# Altium schematic sheet CONTROL.SchDoc
size 558 x 431 mm
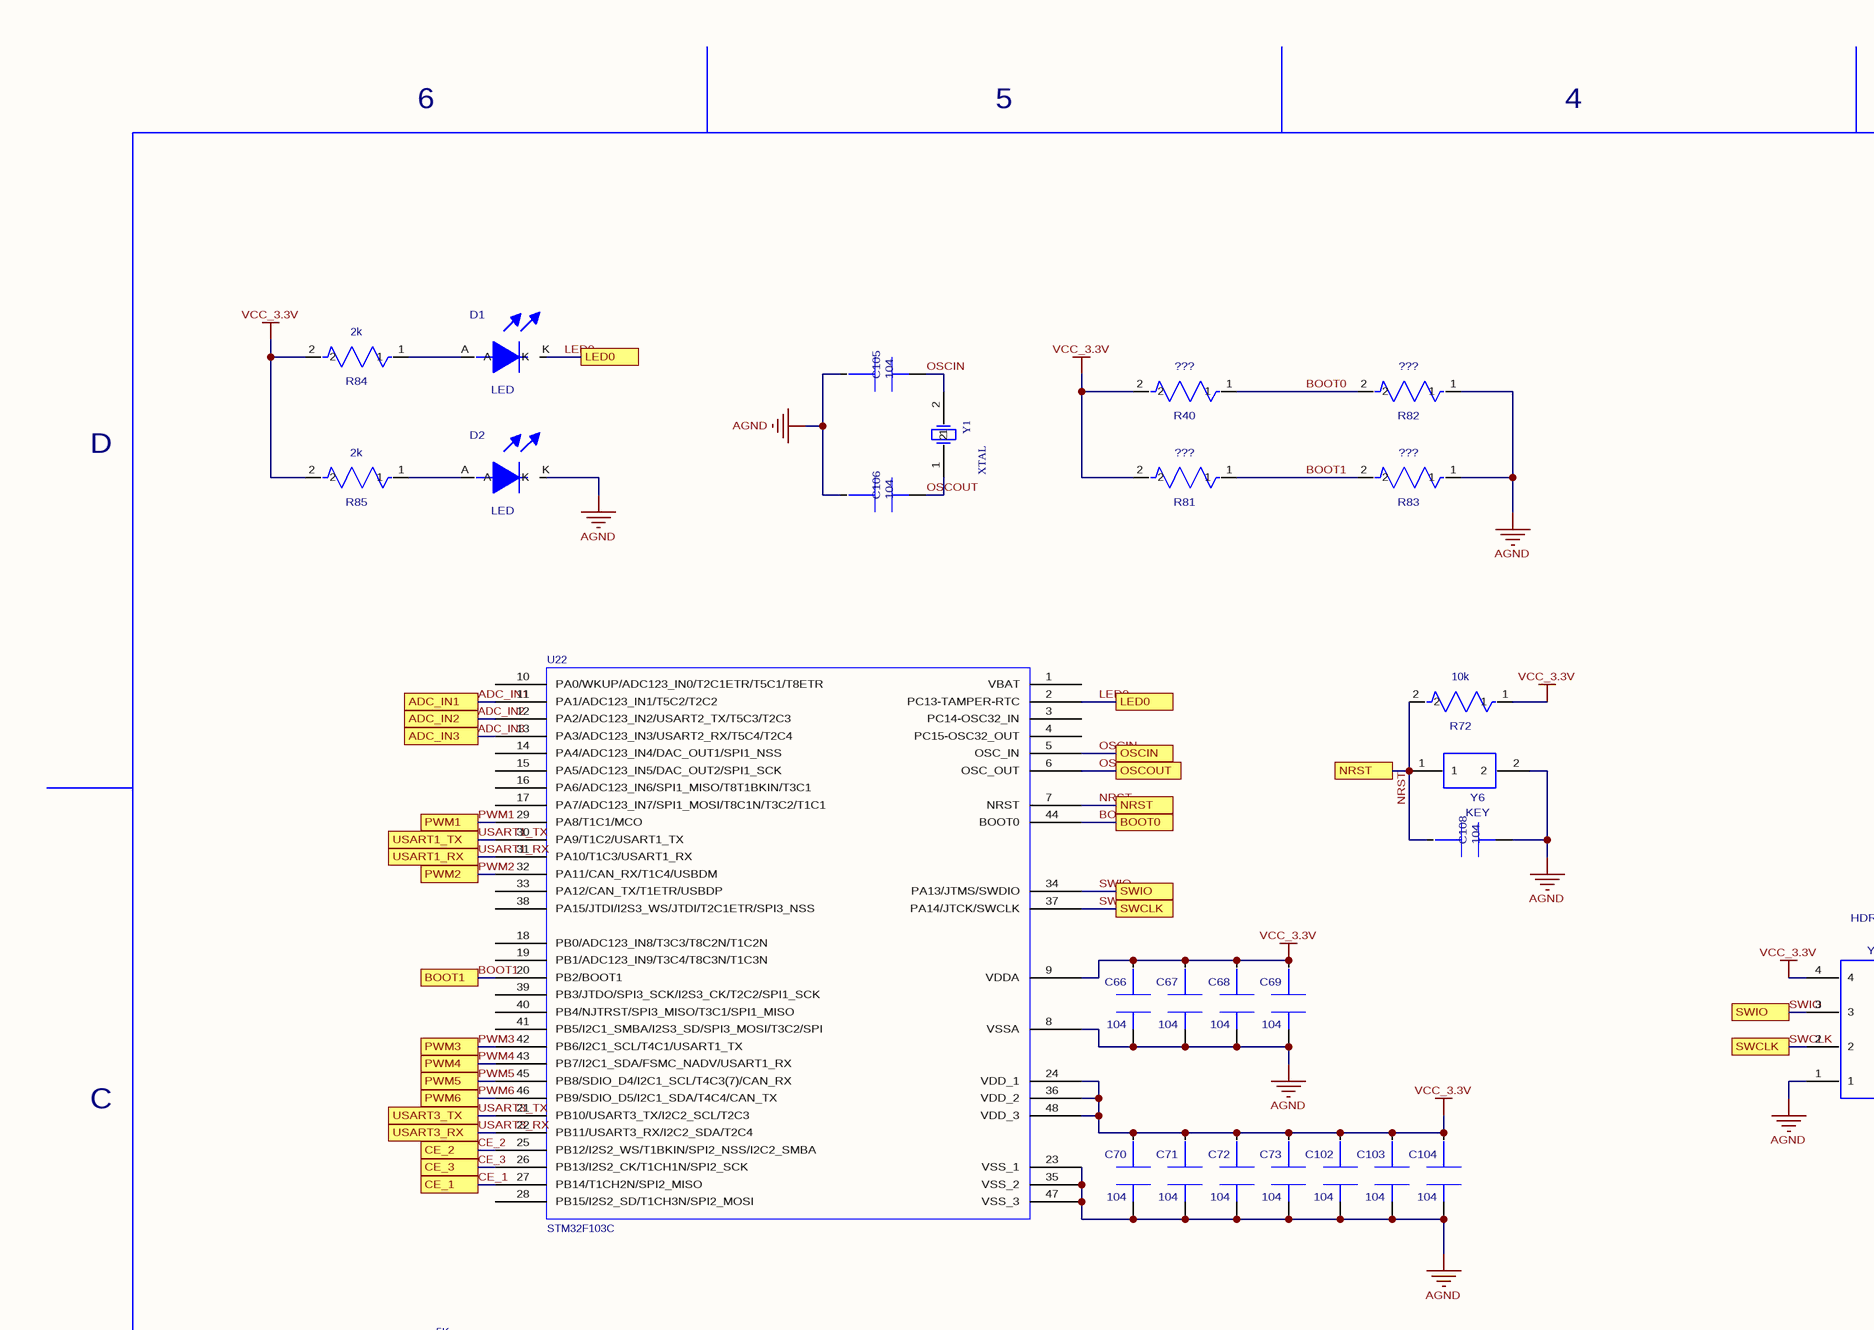
[diagram p0: CONTROL.SchDoc, top left]
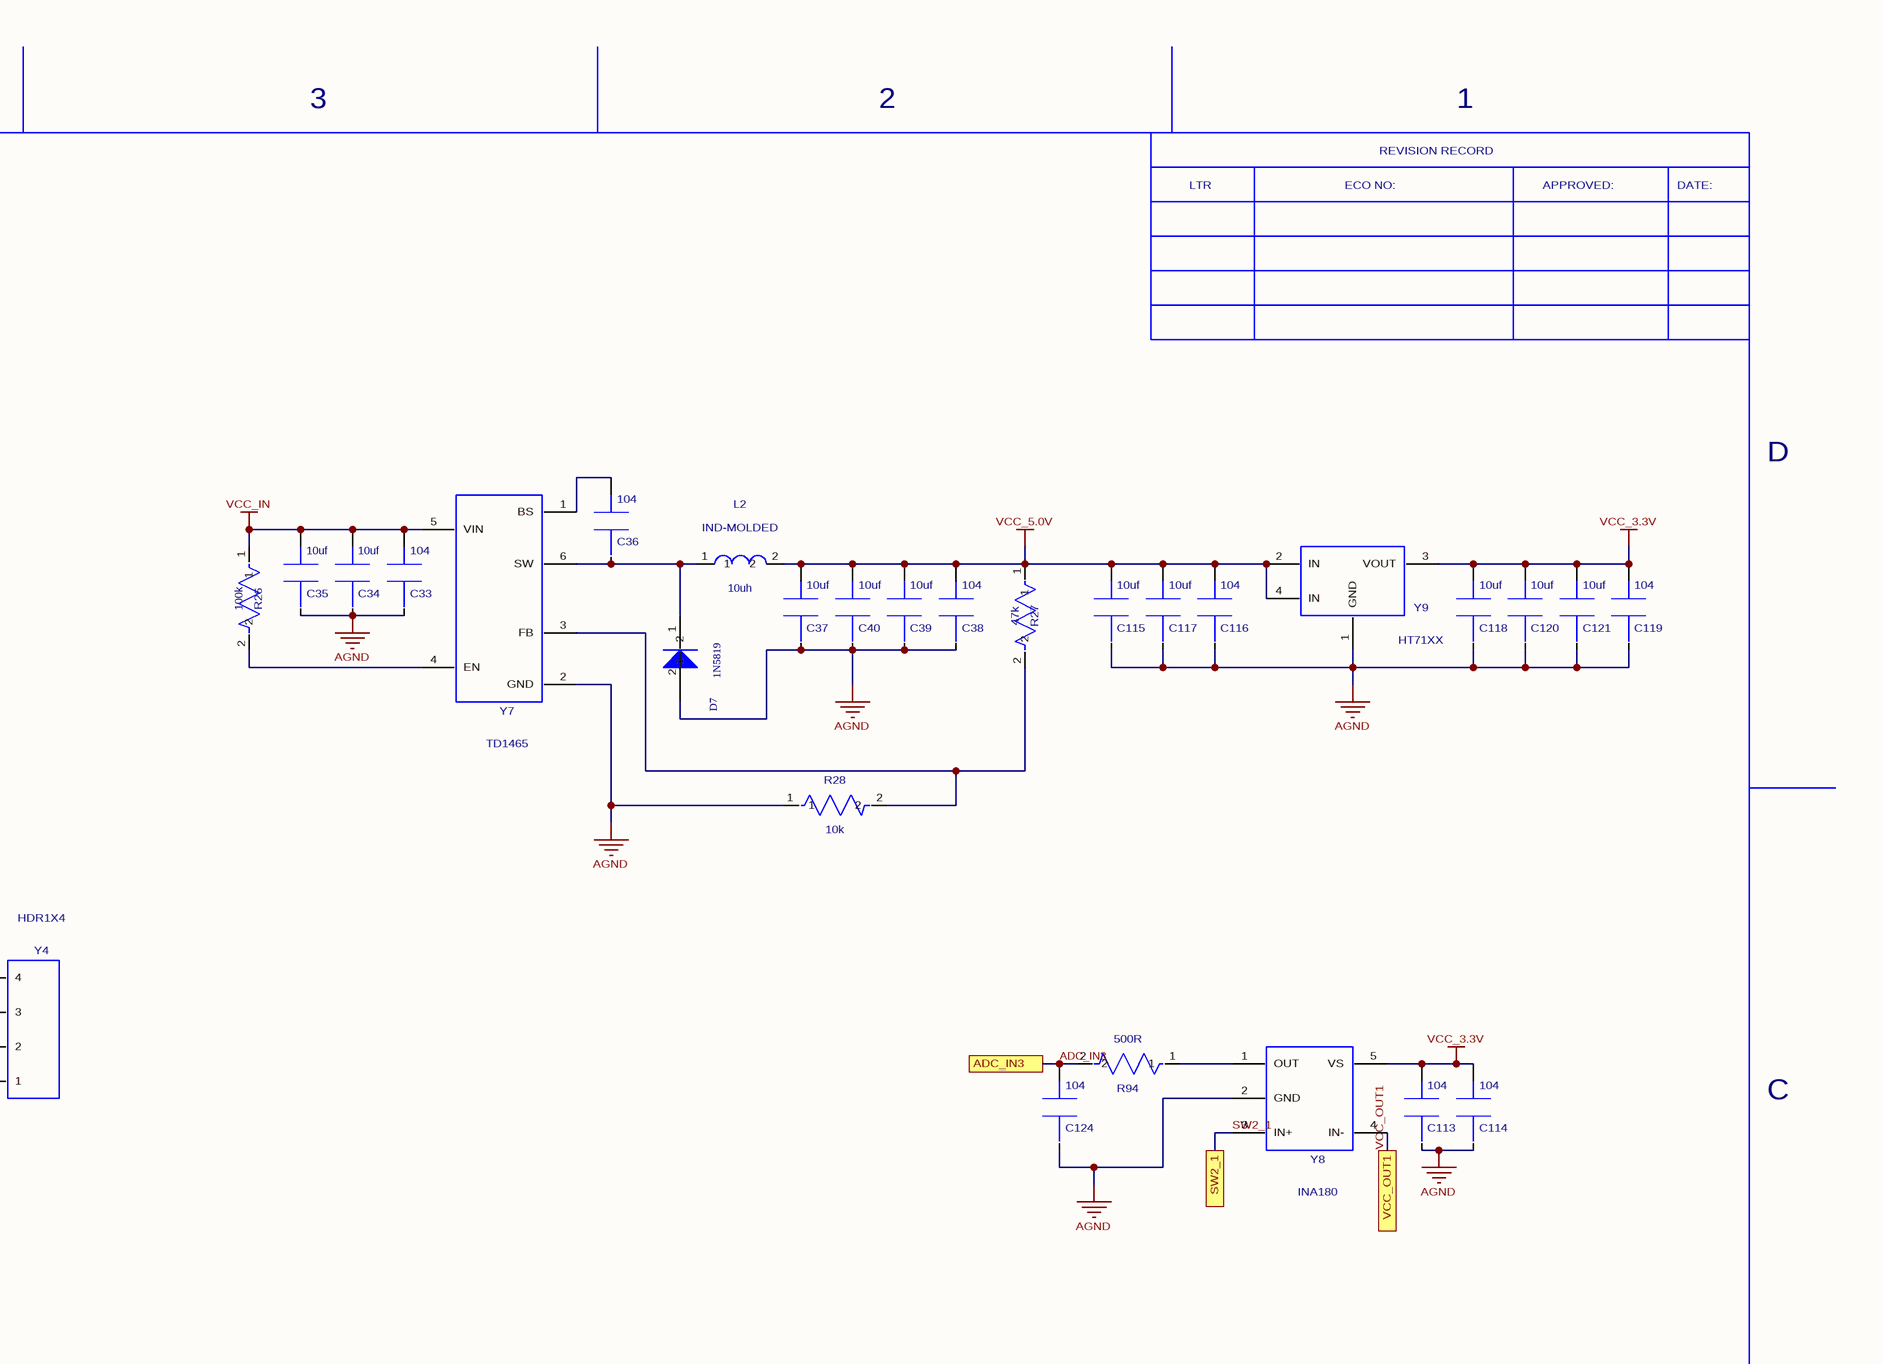
[diagram p1: CONTROL.SchDoc, top right]
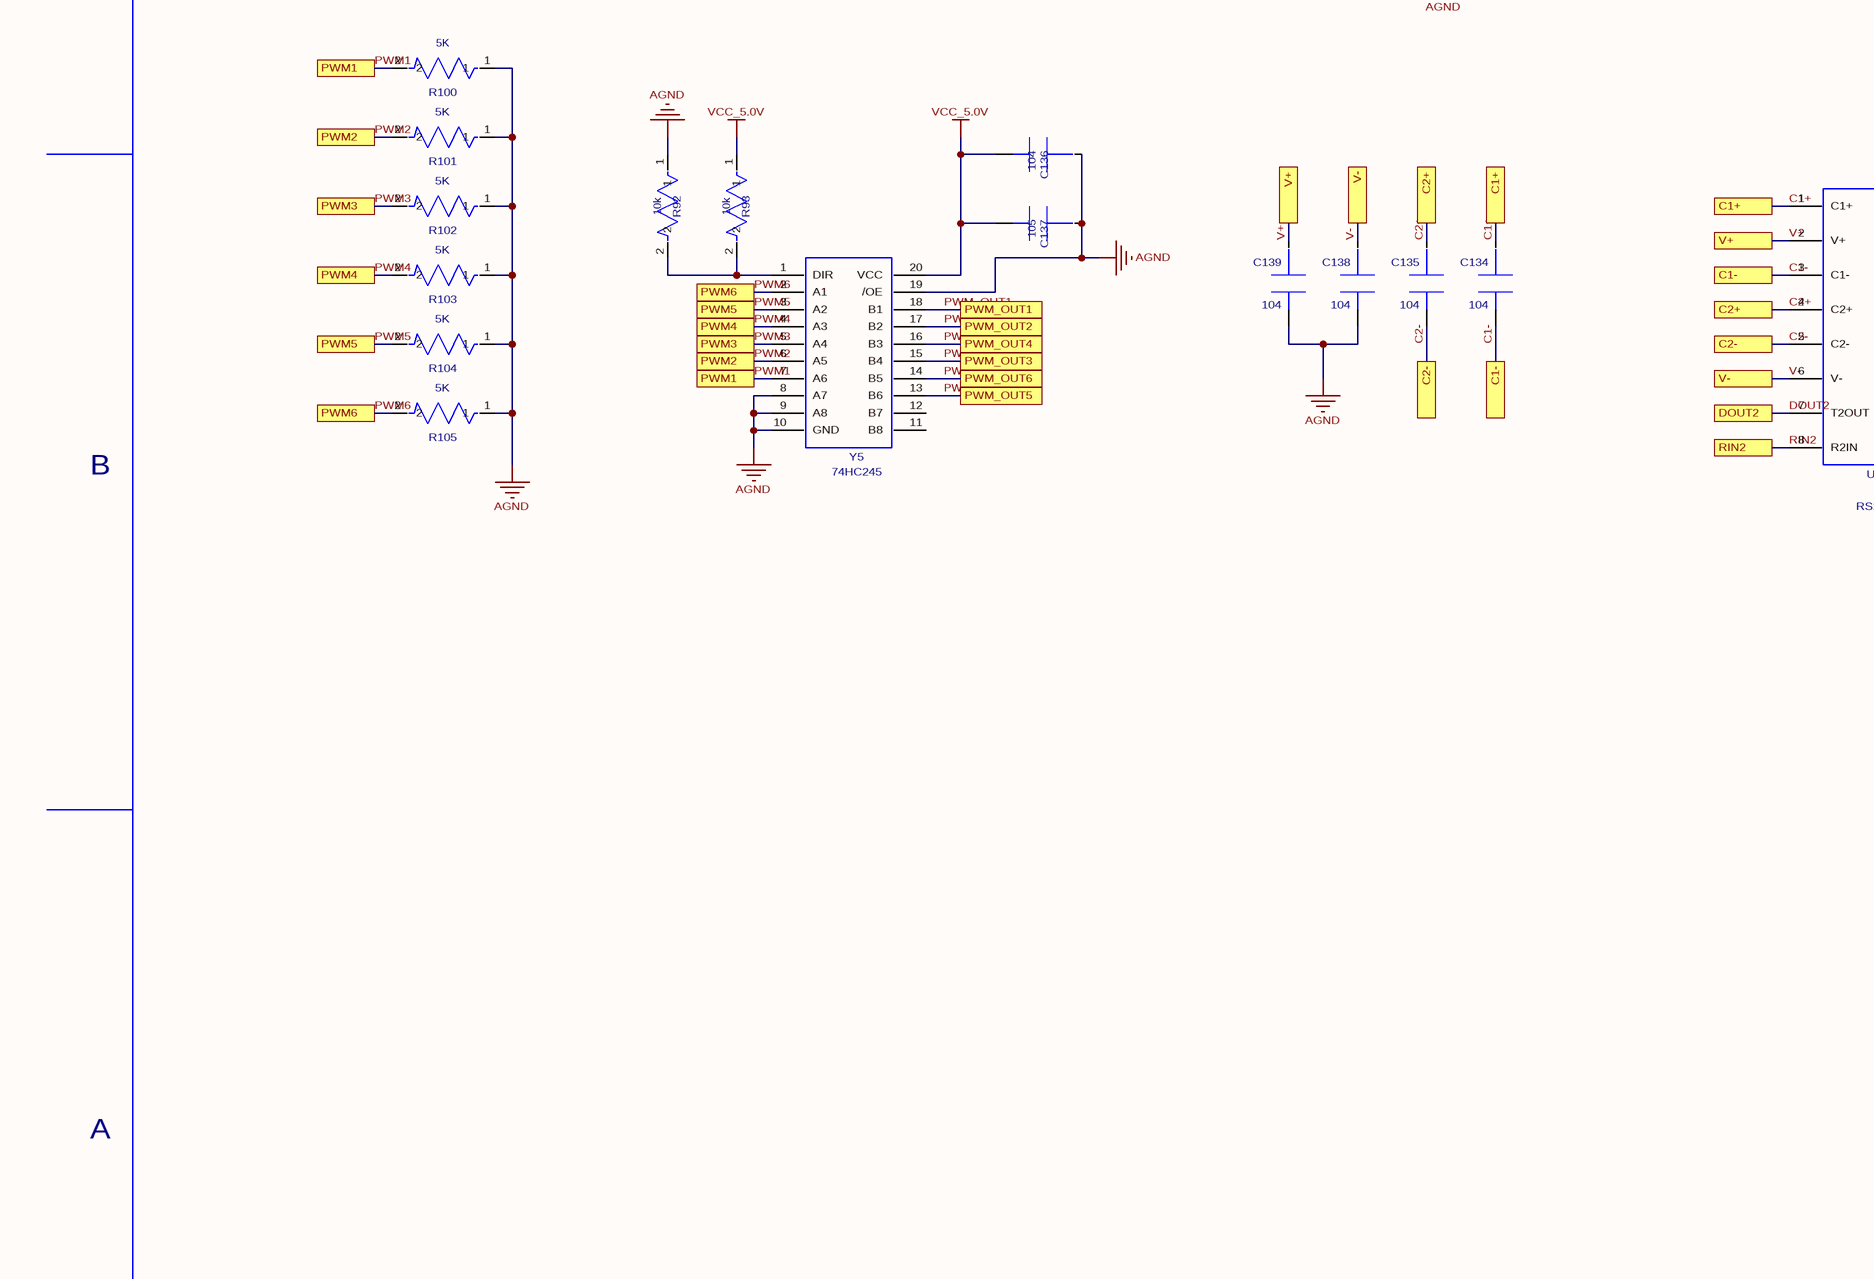
[diagram p2: CONTROL.SchDoc, bottom left]
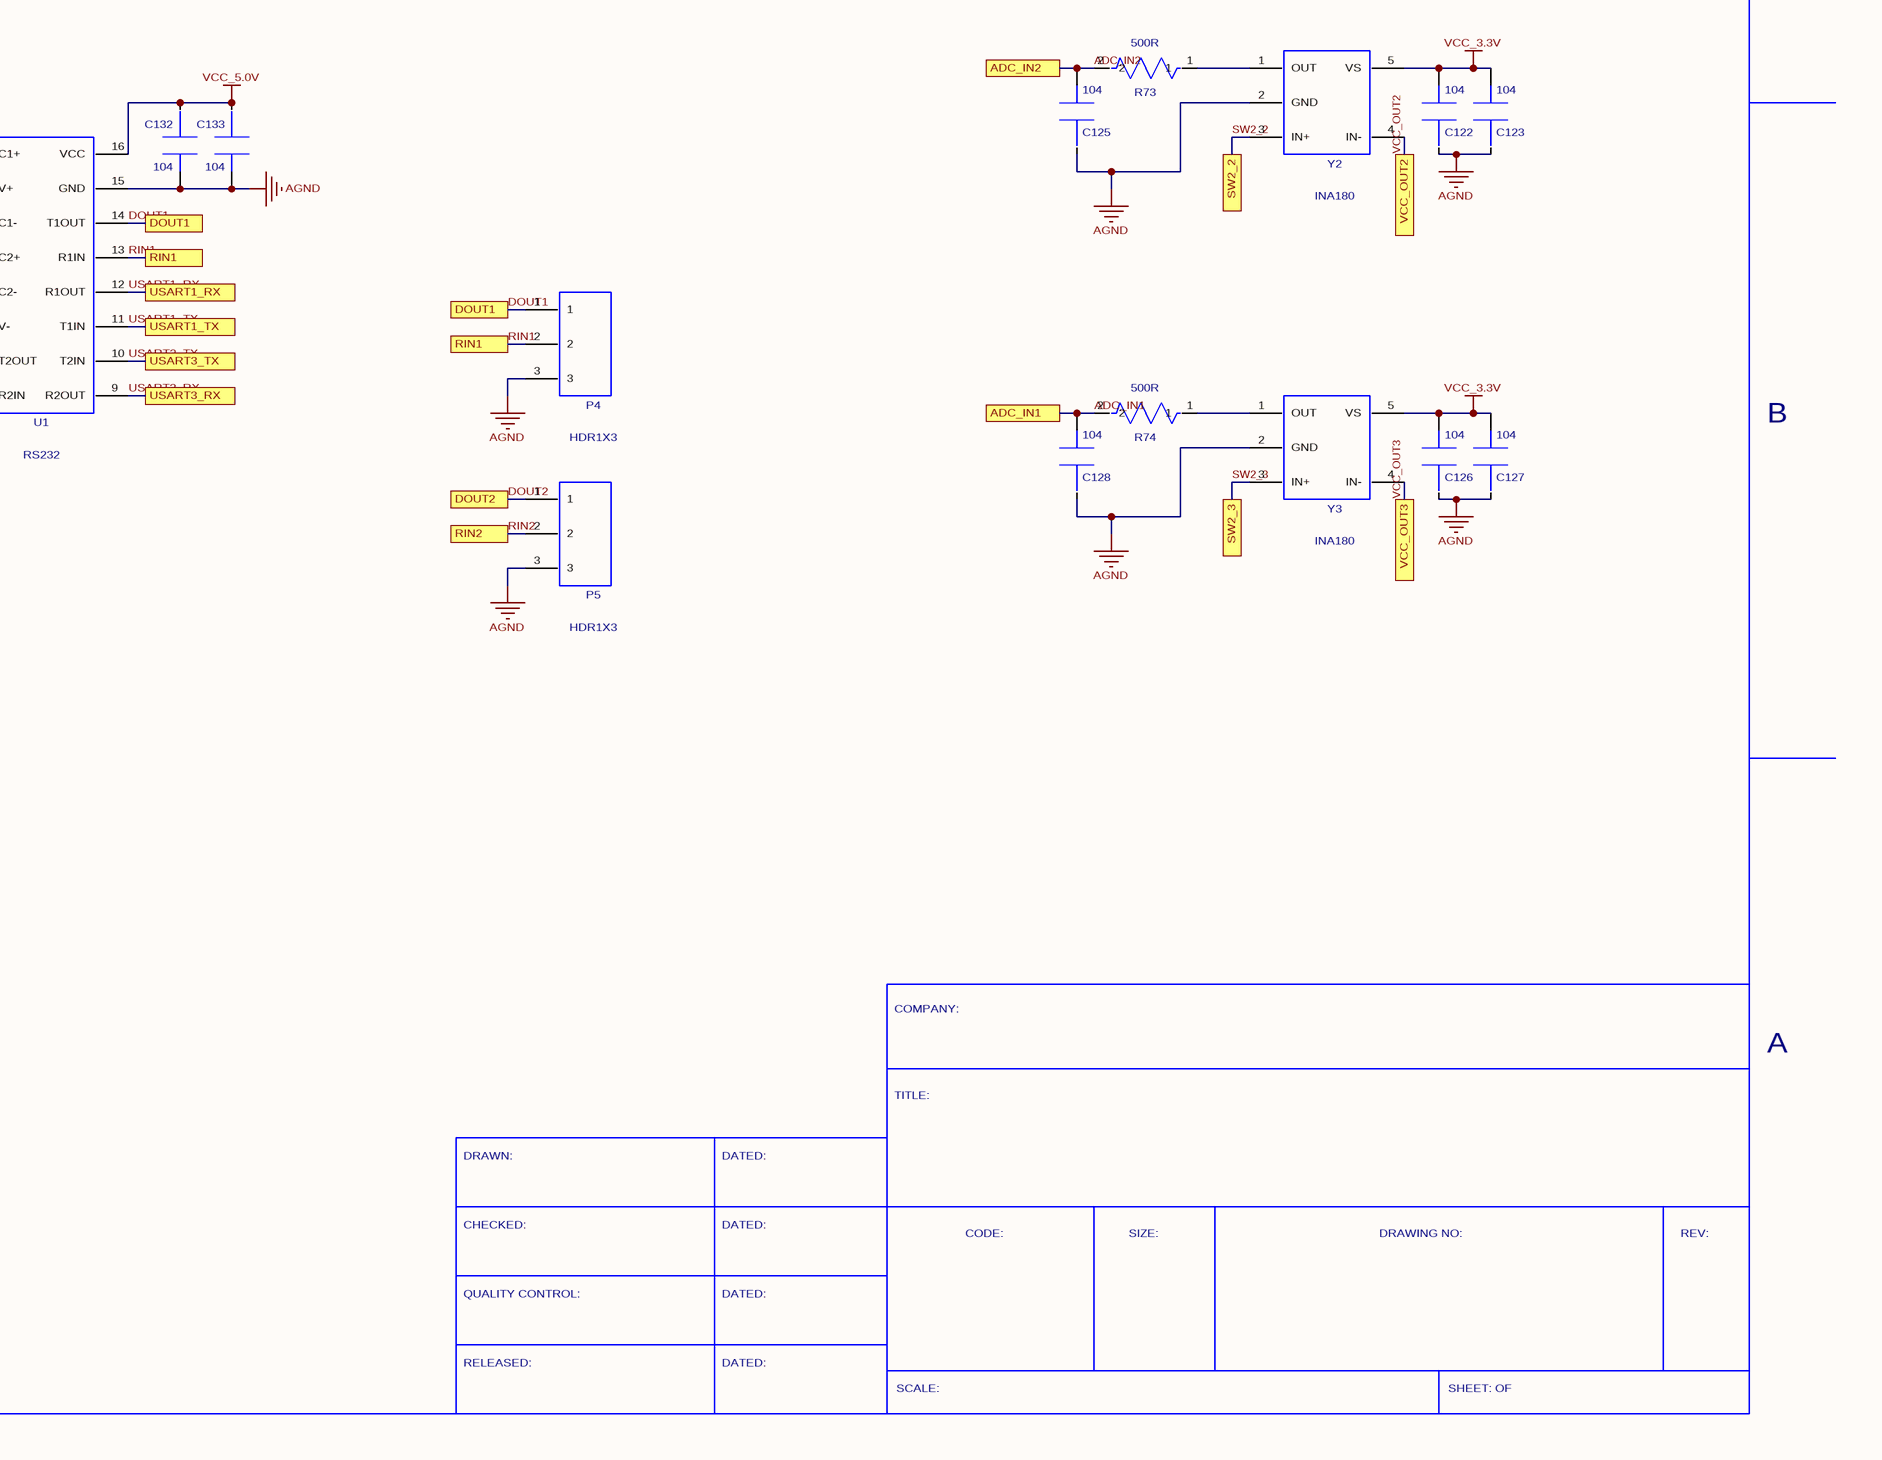
[diagram p3: CONTROL.SchDoc, bottom right]

## Parts
C33  value 104  [0805C]  (hidden comment: CAP-CFR04R-C)
C34  value 10uf  [0805C]  (hidden comment: CAP-CFR04R-C)
C35  value 10uf  [0805C]  (hidden comment: CAP-CFR04R-C)
C36  value 104  [0805C]  (hidden comment: CAP-CFR04R-C)
C37  value 10uf  [0805C]  (hidden comment: CAP-CFR04R-C)
C38  value 104  [0805C]  (hidden comment: CAP-CFR04R-C)
C39  value 10uf  [0805C]  (hidden comment: CAP-CFR04R-C)
C40  value 10uf  [0805C]  (hidden comment: CAP-CFR04R-C)
C66  value 104  [0805C]  (hidden comment: CAP-CFR04R-C)
C67  value 104  [0805C]  (hidden comment: CAP-CFR04R-C)
C68  value 104  [0805C]  (hidden comment: CAP-CFR04R-C)
C69  value 104  [0805C]  (hidden comment: CAP-CFR04R-C)
C70  value 104  [0805C]  (hidden comment: CAP-CFR04R-C)
C71  value 104  [0805C]  (hidden comment: CAP-CFR04R-C)
C72  value 104  [0805C]  (hidden comment: CAP-CFR04R-C)
C73  value 104  [0805C]  (hidden comment: CAP-CFR04R-C)
C102  value 104  [0805C]  (hidden comment: CAP-CFR04R-C)
C103  value 104  [0805C]  (hidden comment: CAP-CFR04R-C)
C104  value 104  [0805C]  (hidden comment: CAP-CFR04R-C)
C105  value 104  [0805C]  (hidden comment: CAP-CFR04R-C)
C106  value 104  [0805C]  (hidden comment: CAP-CFR04R-C)
C108  value 104  [0805C]  (hidden comment: CAP-CFR04R-C)
C113  value 104  [0805C]  (hidden comment: CAP-CFR04R-C)
C114  value 104  [0805C]  (hidden comment: CAP-CFR04R-C)
C115  value 10uf  [0805C]  (hidden comment: CAP-CFR04R-C)
C116  value 104  [0805C]  (hidden comment: CAP-CFR04R-C)
C117  value 10uf  [0805C]  (hidden comment: CAP-CFR04R-C)
C118  value 10uf  [0805C]  (hidden comment: CAP-CFR04R-C)
C119  value 104  [0805C]  (hidden comment: CAP-CFR04R-C)
C120  value 10uf  [0805C]  (hidden comment: CAP-CFR04R-C)
C121  value 10uf  [0805C]  (hidden comment: CAP-CFR04R-C)
C122  value 104  [0805C]  (hidden comment: CAP-CFR04R-C)
C123  value 104  [0805C]  (hidden comment: CAP-CFR04R-C)
C124  value 104  [0805C]  (hidden comment: CAP-CFR04R-C)
C125  value 104  [0805C]  (hidden comment: CAP-CFR04R-C)
C126  value 104  [0805C]  (hidden comment: CAP-CFR04R-C)
C127  value 104  [0805C]  (hidden comment: CAP-CFR04R-C)
C128  value 104  [0805C]  (hidden comment: CAP-CFR04R-C)
C132  value 104  [0805C]  (hidden comment: CAP-CFR04R-C)
C133  value 104  [0805C]  (hidden comment: CAP-CFR04R-C)
C134  value 104  [0805C]  (hidden comment: CAP-CFR04R-C)
C135  value 104  [0805C]  (hidden comment: CAP-CFR04R-C)
C136  value 104  [0805C]  (hidden comment: CAP-CFR04R-C)
C137  value 105  [0603C]  (hidden comment: CAP-CFR04R-C)
C138  value 104  [0805C]  (hidden comment: CAP-CFR04R-C)
C139  value 104  [0805C]  (hidden comment: CAP-CFR04R-C)
D1  LED  [0805D]
D2  LED  [0805D]
D7  1N5819  [SOD-123_L2.8-W1.8-LS3.7-RD]
L2  IND-MOLDED  value 10uh  [L-SMD-0630]
P4  HDR1X3  [POST_3]
P5  HDR1X3  [POST_3]
R26  value 100k  [0603R]  (hidden comment: RES-WR1)
R27  value 47k  [0603R]  (hidden comment: RES-WR1)
R28  value 10k  [0603R]  (hidden comment: RES-WR1)
R40  value ???  [0603R]  (hidden comment: RES-WR1)
R72  value 10k  [0603R]  (hidden comment: RES-WR1)
R73  value 500R  [0603R]  (hidden comment: RES-WR1)
R74  value 500R  [0603R]  (hidden comment: RES-WR1)
R81  value ???  [0603R]  (hidden comment: RES-WR1)
R82  value ???  [0603R]  (hidden comment: RES-WR1)
R83  value ???  [0603R]  (hidden comment: RES-WR1)
R84  value 2k  [0805R]  (hidden comment: RES-WR1)
R85  value 2k  [0805R]  (hidden comment: RES-WR1)
R92  value 10k  [0603R]  (hidden comment: RES-WR1)
R93  value 10k  [0603R]  (hidden comment: RES-WR1)
R94  value 500R  [0603R]  (hidden comment: RES-WR1)
R100  value 5K  [0603R]  (hidden comment: RES-WR1)
R101  value 5K  [0603R]  (hidden comment: RES-WR1)
R102  value 5K  [0603R]  (hidden comment: RES-WR1)
R103  value 5K  [0603R]  (hidden comment: RES-WR1)
R104  value 5K  [0603R]  (hidden comment: RES-WR1)
R105  value 5K  [0603R]  (hidden comment: RES-WR1)
U1  RS232  [SOP-16_L9.9-W3.9-P1.27-LS6.1-BL]
U22  STM32F103C  [LQFP-48_M]
Y1  XTAL  [HC-49S_L11.4-W4.8]
Y2  INA180  [SOT-23-5_L3.0-W1.7-P0.95-LS2.8-BL]
Y3  INA180  [SOT-23-5_L3.0-W1.7-P0.95-LS2.8-BL]
Y4  HDR1X4  [HDR1X4]
Y5  74HC245  [TSSOP-20_L6.5-W4.4-P0.65-LS6.4-BL]
Y6  KEY  [KEY_3_6_2.5]
Y7  TD1465  [SOT-23-6]
Y8  INA180  [SOT-23-5_L3.0-W1.7-P0.95-LS2.8-BL]
Y9  HT71XX  [SOT-89-3_L4.5-W2.5-P1.50-LS4.2-BR]

## Ports
ADC_IN1, ADC_IN2, ADC_IN3, BOOT0, BOOT1, C1+, C1-, C2+, C2-, CE_1, CE_2, CE_3, DOUT1, DOUT2, LED0, NRST, OSCIN, OSCOUT, PWM1, PWM2, PWM3, PWM4, PWM5, PWM6, PWM_OUT1, PWM_OUT2, PWM_OUT3, PWM_OUT4, PWM_OUT5, PWM_OUT6, RIN1, RIN2, SW2_1, SW2_2, SW2_3, SWCLK, SWIO, USART1_RX, USART1_TX, USART3_RX, USART3_TX, V+, V-, VCC_OUT1, VCC_OUT2, VCC_OUT3

## Nets
AGND: C33.1 C34.1 C35.1 C37.1 C38.1 C39.1 C40.1 C66.2 C67.2 C68.2 C69.2 C70.2 C71.2 C72.2 C73.2 C102.2 C103.2 C104.2 C105.1 C106.1 C108.2 C113.1 C114.1 C115.1 C116.1 C117.1 C118.1 C119.1 C120.1 C121.1 C122.1 C123.1 C124.1 C125.1 C126.1 C127.1 C128.1 C132.2 C133.2 C136.1 C137.1 C138.2 C139.2 D2.K D7.2 P4.3 P5.3 R28.1 R82.1 R83.1 R92.1 R100.1 R101.1 R102.1 R103.1 R104.1 R105.1 U1.15(GND) U22.8(VSSA) U22.23(VSS_1) U22.35(VSS_2) U22.47(VSS_3) Y2.2(GND) Y3.2(GND) Y4.1 Y5.8(A7) Y5.9(A8) Y5.10(GND) Y5.19(/OE) Y6.2 Y7.2(GND) Y8.2(GND) Y9.1(GND)
VCC_3.3V: C66.1 C67.1 C68.1 C69.1 C70.1 C71.1 C72.1 C73.1 C102.1 C103.1 C104.1 C113.2 C114.2 C118.2 C119.2 C120.2 C121.2 C122.2 C123.2 C126.2 C127.2 R40.2 R72.1 R81.2 R84.2 R85.2 U22.9(VDDA) U22.24(VDD_1) U22.36(VDD_2) U22.48(VDD_3) Y2.5(VS) Y3.5(VS) Y4.4 Y8.5(VS) Y9.3(VOUT)
VCC_5.0V: C37.2 C38.2 C39.2 C40.2 C115.2 C116.2 C117.2 C132.1 C133.1 C136.2 C137.2 L2.2 R27.1 R93.1 U1.16(VCC) Y5.20(VCC) Y9.2(IN) Y9.4(IN)
VCC_IN: C33.2 C34.2 C35.2 R26.1 Y7.5(VIN)
ADC_IN1: C128.2 R74.2 U22.11(PA1/ADC123_IN1/T5C2/T2C2) ; port ADC_IN1
ADC_IN2: C125.2 R73.2 U22.12(PA2/ADC123_IN2/USART2_TX/T5C3/T2C3) ; port ADC_IN2
ADC_IN3: C124.2 R94.2 U22.13(PA3/ADC123_IN3/USART2_RX/T5C4/T2C4) ; port ADC_IN3
BOOT0: R40.1 R82.2 U22.44(BOOT0) ; port BOOT0
BOOT1: R81.1 R83.2 U22.20(PB2/BOOT1) ; port BOOT1
C1+: C134.1 U1.1(C1+) ; port C1+
C1-: C134.2 U1.3(C1-) ; port C1-
C2+: C135.1 U1.4(C2+) ; port C2+
C2-: C135.2 U1.5(C2-) ; port C2-
CE_1: U22.27(PB14/T1CH2N/SPI2_MISO) ; port CE_1
CE_2: U22.25(PB12/I2S2_WS/T1BKIN/SPI2_NSS/I2C2_SMBA) ; port CE_2
CE_3: U22.26(PB13/I2S2_CK/T1CH1N/SPI2_SCK) ; port CE_3
DOUT1: P4.1 U1.14(T1OUT) ; port DOUT1
DOUT2: P5.1 U1.7(T2OUT) ; port DOUT2
LED0: D1.K U22.2(PC13-TAMPER-RTC) ; port LED0
NRST: C108.1 R72.2 U22.7(NRST) Y6.1 ; port NRST
OSCIN: C105.2 U22.5(OSC_IN) Y1.2 ; port OSCIN
OSCOUT: C106.2 U22.6(OSC_OUT) Y1.1 ; port OSCOUT
PWM1: R100.2 U22.29(PA8/T1C1/MCO) Y5.7(A6) ; port PWM1
PWM2: R101.2 U22.32(PA11/CAN_RX/T1C4/USBDM) Y5.6(A5) ; port PWM2
PWM3: R102.2 U22.42(PB6/I2C1_SCL/T4C1/USART1_TX) Y5.5(A4) ; port PWM3
PWM4: R103.2 U22.43(PB7/I2C1_SDA/FSMC_NADV/USART1_RX) Y5.4(A3) ; port PWM4
PWM5: R104.2 U22.45(PB8/SDIO_D4/I2C1_SCL/T4C3(7)/CAN_RX) Y5.3(A2) ; port PWM5
PWM6: R105.2 U22.46(PB9/SDIO_D5/I2C1_SDA/T4C4/CAN_TX) Y5.2(A1) ; port PWM6
PWM_OUT1: Y5.18(B1) ; port PWM_OUT1
PWM_OUT2: Y5.17(B2) ; port PWM_OUT2
PWM_OUT3: Y5.15(B4) ; port PWM_OUT3
PWM_OUT4: Y5.16(B3) ; port PWM_OUT4
PWM_OUT5: Y5.13(B6) ; port PWM_OUT5
PWM_OUT6: Y5.14(B5) ; port PWM_OUT6
RIN1: P4.2 U1.13(R1IN) ; port RIN1
RIN2: P5.2 U1.8(R2IN) ; port RIN2
SW2_1: Y8.3(IN+) ; port SW2_1
SW2_2: Y2.3(IN+) ; port SW2_2
SW2_3: Y3.3(IN+) ; port SW2_3
SWCLK: U22.37(PA14/JTCK/SWCLK) Y4.2 ; port SWCLK
SWIO: U22.34(PA13/JTMS/SWDIO) Y4.3 ; port SWIO
USART1_RX: U1.12(R1OUT) U22.31(PA10/T1C3/USART1_RX) ; port USART1_RX
USART1_TX: U1.11(T1IN) U22.30(PA9/T1C2/USART1_TX) ; port USART1_TX
USART3_RX: U1.9(R2OUT) U22.22(PB11/USART3_RX/I2C2_SDA/T2C4) ; port USART3_RX
USART3_TX: U1.10(T2IN) U22.21(PB10/USART3_TX/I2C2_SCL/T2C3) ; port USART3_TX
V+: C139.1 U1.2(V+) ; port V+
V-: C138.1 U1.6(V-) ; port V-
VCC_OUT1: Y8.4(IN-) ; port VCC_OUT1
VCC_OUT2: Y2.4(IN-) ; port VCC_OUT2
VCC_OUT3: Y3.4(IN-) ; port VCC_OUT3
NetC36_1: C36.1 D7.1 L2.1 Y7.6(SW)
NetC36_2: C36.2 Y7.1(BS)
NetD1_A: D1.A R84.1
NetD2_A: D2.A R85.1
NetR26_2: R26.2 Y7.4(EN)
NetR27_2: R27.2 R28.2 Y7.3(FB)
NetR73_1: R73.1 Y2.1(OUT)
NetR74_1: R74.1 Y3.1(OUT)
NetR92_2: R92.2 R93.2 Y5.1(DIR)
NetR94_1: R94.1 Y8.1(OUT)

Not connected (* = marked no-connect by the designer): U22 1(VBAT) 3(PC14-OSC32_IN) 4(PC15-OSC32_OUT) 10(PA0/WKUP/ADC123_IN0/T2C1ETR/T5C1/T8ETR) 14(PA4/ADC123_IN4/DAC_OUT1/SPI1_NSS) 15(PA5/ADC123_IN5/DAC_OUT2/SPI1_SCK) 16(PA6/ADC123_IN6/SPI1_MISO/T8T1BKIN/T3C1) 17(PA7/ADC123_IN7/SPI1_MOSI/T8C1N/T3C2/T1C1) 18(PB0/ADC123_IN8/T3C3/T8C2N/T1C2N) 19(PB1/ADC123_IN9/T3C4/T8C3N/T1C3N) 28(PB15/I2S2_SD/T1CH3N/SPI2_MOSI) 33(PA12/CAN_TX/T1ETR/USBDP) 38(PA15/JTDI/I2S3_WS/JTDI/T2C1ETR/SPI3_NSS) 39(PB3/JTDO/SPI3_SCK/I2S3_CK/T2C2/SPI1_SCK) 40(PB4/NJTRST/SPI3_MISO/T3C1/SPI1_MISO) 41(PB5/I2C1_SMBA/I2S3_SD/SPI3_MOSI/T3C2/SPI); Y5 11(B8) 12(B7)

## Notes on the sheet
- 6
- 5
- 4
- 3
- 2
- 1
- LTR
- ECO NO:
- REVISION RECORD
- APPROVED:
- DATE:
- D
- C
- B
- COMPANY:
- A
- TITLE:
- DRAWN:
- DATED:
- CHECKED:
- CODE:
- SIZE:
- DRAWING NO:
- REV:
- QUALITY CONTROL:
- RELEASED:
- SCALE:
- SHEET: OF

## Library data of the parts
C33-C40 C66-C73 C102-C106 C108 C113-C128 C132-C139 = CAP-CFR04R-C: RADIAL FILM CAPACITOR, MIL-SPEC SIZE CFR04R SIZE 'C'; Manufacturer #1: KEMET; Part Number: TBD; Voltage Rating: ???; Sim.Analog.Prefix: C; Sim.Analog.Order: Model$; Tolerance: ???
  C33-C40 C66-C73 C102-C106 C108 C113-C128 C132-C136 C138 C139: PCB DECAL: 0805C
  C137: PCB DECAL: 0603C
D1 D2 = LED: LIGHT EMITTING DIODE; Sim.Analog.Order: Model$; Sim.Analog.Prefix: D; Color: ???; PCB DECAL: 0805D
D7 = DIODE_1N4148: High Conductance Fast Diode; ComponentLink2URL: http://www.fairchildsemi.com/ds/1N%2F1N4148.pdf; ComponentLink2Description: Datasheet; ComponentLink1URL: http://www.fairchildsemi.com/; ComponentLink1Description: Manufacturer Link; Code_JEDEC: DO-204-AH; PackageDescription: Diode, Axial; Body 3.8 x 1.9 mm (LxDia. max), Lead Dia. 0.53 mm (max); Publisher: Altium Limited; PackageReference: DO-35; DatasheetVersion: 1997; LatestRevisionNote: Re-released for DXP Platform.; LatestRevisionDate: 17-Jul-2002; Published: 8-Jun-2000; PCB DECAL: SOD-123_L2.8-W1.8-LS3.7-RD; Comment_1: DIODE_1N4148
L2 = IND-MOLDED: MOLDED INDUCTOR, 0.5" PIN SPACING; Sim.Analog.Order: Model$; Sim.Analog.Prefix: L; PCB DECAL: L-SMD-0630
R26-R28 R40 R72-R74 R81-R85 R92-R94 R100-R105 = RES-WR1: WIRE WOUND RESISTOR 3.4 X 7.05 MM; Manufacturer #1: IPC SM-782 STD.; Sim.Analog.Order: Model$; Sim.Analog.Prefix: R
  R26-R28 R40 R72-R74 R81-R83 R92-R94 R100-R105: PCB DECAL: 0603R
  R84 R85: PCB DECAL: 0805R
U22 = STM32F103C: STM32单片机48引脚; PCB DECAL: LQFP-48_M; Comment_1: STM32F103C
Y1 = XTAL: Crystal Oscillator; PackageDescription: Crystal, Thru-Hole; 2 Leads; Body 3.1 x 8.2 mm (Dia.xH); Publisher: Altium Limited; PackageReference: R38; LatestRevisionNote: Re-released for DXP Platform.; LatestRevisionDate: 17-Jul-2002; Published: 8-Jun-2000; PCB DECAL: HC-49S_L11.4-W4.8; Comment_1: XTAL
Y5 = 74HC04: PCB DECAL: TSSOP-20_L6.5-W4.4-P0.65-LS6.4-BL
P4 P5 = HDR1X3: PCB DECAL: POST_3
U1 = RS232: PCB DECAL: SOP-16_L9.9-W3.9-P1.27-LS6.1-BL
Y2 Y3 Y8 = INA180: PCB DECAL: SOT-23-5_L3.0-W1.7-P0.95-LS2.8-BL
Y4 = HDR1X4: PCB DECAL: HDR1X4
Y6 = KEY: PCB DECAL: KEY_3_6_2.5
Y7 = TD1465: PCB DECAL: SOT-23-6
Y9 = HT71XX: PCB DECAL: SOT-89-3_L4.5-W2.5-P1.50-LS4.2-BR